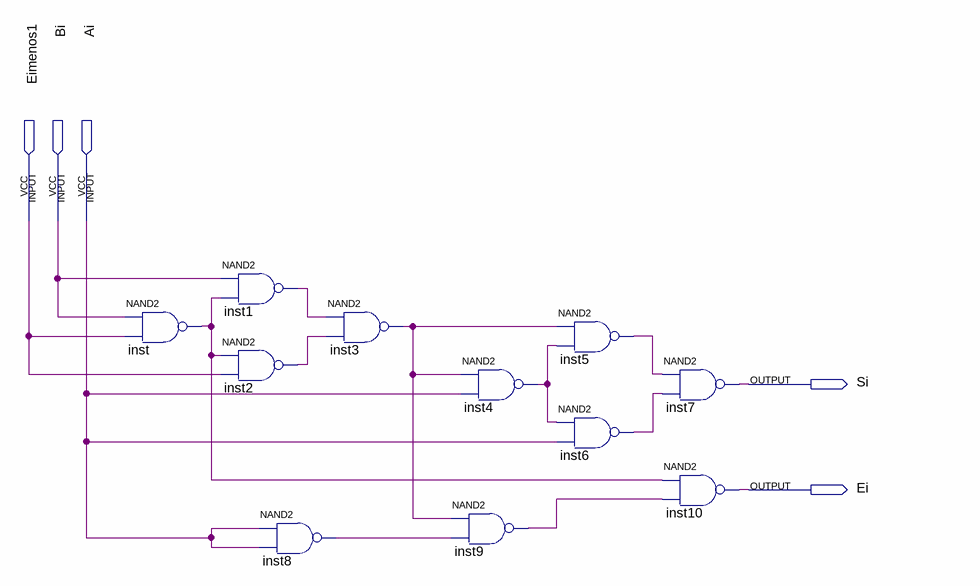
[diagram p0: schematic sheet]
// Quartus schematic q53.bdf as structural Verilog: 11 symbols, 5 pins
module q53 (
  input  Eimenos1,
  input  Bi,
  input  Ai,
  output Si,
  output Ei
);

  wire inst1_out, inst2_out, inst3_out, inst4_out, inst5_out, inst6_out, inst8_out, inst9_out, inst_out;

  nand inst (inst_out, Bi, Eimenos1);
  nand inst1 (inst1_out, Bi, inst_out);
  nand inst2 (inst2_out, inst_out, Eimenos1);
  nand inst8 (inst8_out, Ai, Ai);
  nand inst3 (inst3_out, inst1_out, inst2_out);
  nand inst4 (inst4_out, inst3_out, Ai);
  nand inst9 (inst9_out, inst3_out, inst8_out);
  nand inst5 (inst5_out, inst3_out, inst4_out);
  nand inst6 (inst6_out, inst4_out, Ai);
  nand inst7 (Si, inst5_out, inst6_out);
  nand inst10 (Ei, inst_out, inst9_out);
endmodule
